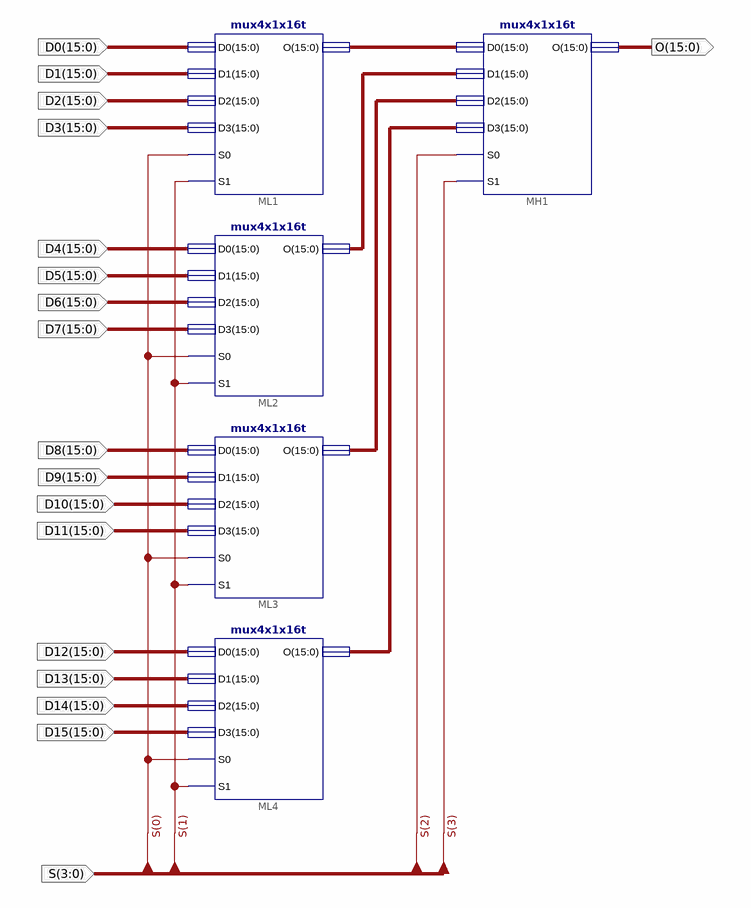
[diagram p0: schematic sheet 1]
// Xilinx ISE schematic mux16x1x16tb.sch (spartan6) as structural Verilog: 5 symbols, 18 ports
module mux16x1x16tb (
  input  [15:0] D0,
  input  [15:0] D1,
  input  [15:0] D2,
  input  [15:0] D3,
  input  [15:0] D4,
  input  [15:0] D5,
  input  [15:0] D6,
  input  [15:0] D7,
  input  [15:0] D8,
  input  [15:0] D9,
  input  [15:0] D10,
  input  [15:0] D11,
  input  [15:0] D12,
  input  [15:0] D13,
  input  [15:0] D14,
  input  [15:0] D15,
  input  [3:0] S,
  output [15:0] O
);

  wire [15:0] XLXN_1, XLXN_2, XLXN_3, XLXN_4;

  mux4x1x16t ML1 (.D0(D0), .D1(D1), .D2(D2), .D3(D3), .O(XLXN_1), .S0(S[0]), .S1(S[1]));
  mux4x1x16t ML2 (.D0(D4), .D1(D5), .D2(D6), .D3(D7), .O(XLXN_2), .S0(S[0]), .S1(S[1]));
  mux4x1x16t ML3 (.D0(D8), .D1(D9), .D2(D10), .D3(D11), .O(XLXN_3), .S0(S[0]), .S1(S[1]));
  mux4x1x16t ML4 (.D0(D12), .D1(D13), .D2(D14), .D3(D15), .O(XLXN_4), .S0(S[0]), .S1(S[1]));
  mux4x1x16t MH1 (.D0(XLXN_1), .D1(XLXN_2), .D2(XLXN_3), .D3(XLXN_4), .O(O), .S0(S[2]), .S1(S[3]));
endmodule
